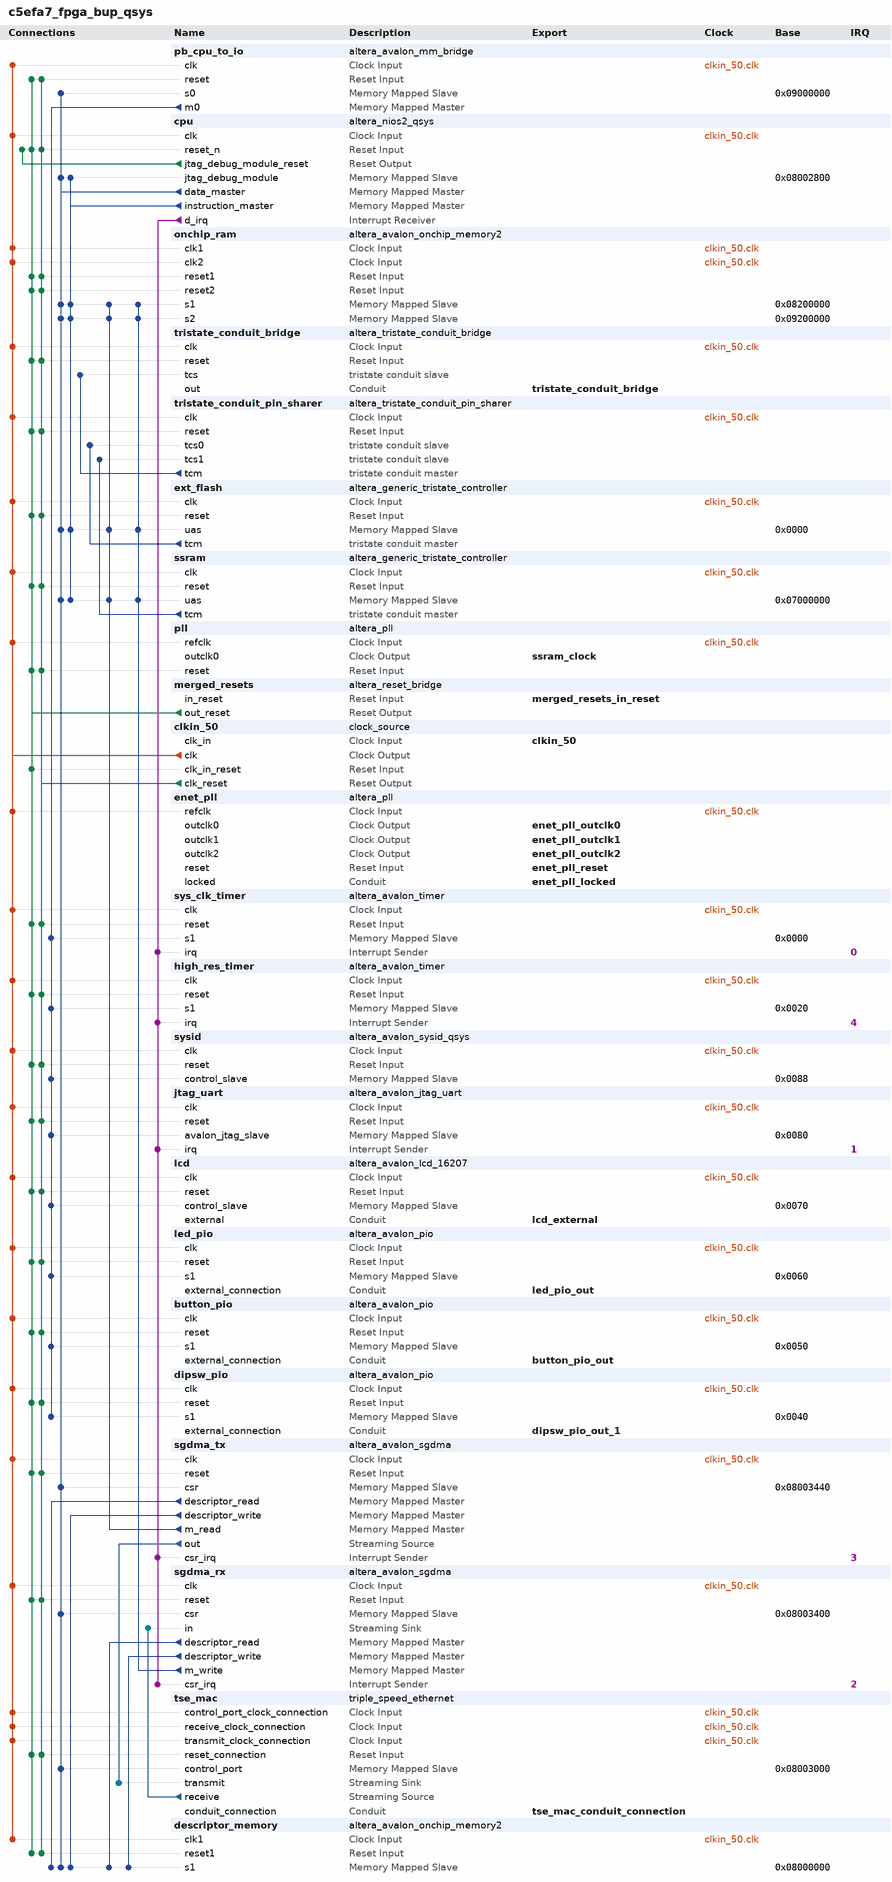
[diagram p0: system contents]
# Platform Designer (Qsys) system c5efa7_fpga_bup_qsys, Cyclone V 5CEFA7F31I7
# Parameters at their usual value, and those the tool derives, are not listed.
package require -exact qsys 12.1
create_system c5efa7_fpga_bup_qsys
set_project_property DEVICE_FAMILY {Cyclone V}
set_project_property DEVICE 5CEFA7F31I7

add_instance pb_cpu_to_io altera_avalon_mm_bridge 12.1
set_instance_parameter_value pb_cpu_to_io DATA_WIDTH 32
set_instance_parameter_value pb_cpu_to_io ADDRESS_WIDTH 10
set_instance_parameter_value pb_cpu_to_io ADDRESS_UNITS SYMBOLS
set_instance_parameter_value pb_cpu_to_io MAX_PENDING_RESPONSES 19

add_instance cpu altera_nios2_qsys 12.1
set_instance_parameter_value cpu manuallyAssignCpuID false
set_instance_parameter_value cpu resetOffset 29097984
set_instance_parameter_value cpu resetSlave ext_flash.uas
set_instance_parameter_value cpu exceptionSlave onchip_ram.s1
set_instance_parameter_value cpu breakSlave cpu.jtag_debug_module
set_instance_parameter_value cpu impl Fast
set_instance_parameter_value cpu icache_size 32768
set_instance_parameter_value cpu dcache_size 32768

add_instance onchip_ram altera_avalon_onchip_memory2 12.1
set_instance_parameter_value onchip_ram blockType M10K
set_instance_parameter_value onchip_ram dataWidth 32
set_instance_parameter_value onchip_ram dualPort true
set_instance_parameter_value onchip_ram initMemContent true
set_instance_parameter_value onchip_ram initializationFileName onchip_ram
set_instance_parameter_value onchip_ram memorySize 524288

add_instance tristate_conduit_bridge altera_tristate_conduit_bridge 12.1

add_instance tristate_conduit_pin_sharer altera_tristate_conduit_pin_sharer 12.1
set_instance_parameter_value tristate_conduit_pin_sharer NUM_INTERFACES 2
set_instance_parameter_value tristate_conduit_pin_sharer MODULE_ORIGIN_LIST ssram.tcm,ssram.tcm,ssram.tcm,ssram.tcm,ssram.tcm,ssram.tcm,ext_flash.tcm,ext_flash.tcm,ext_flash.tcm,ext_flash.tcm,ext_flash.tcm
set_instance_parameter_value tristate_conduit_pin_sharer SIGNAL_ORIGIN_LIST address,outputenable_n,byteenable_n,write_n,data,chipselect_n,address,read_n,write_n,data,chipselect_n
set_instance_parameter_value tristate_conduit_pin_sharer SHARED_SIGNAL_LIST fsm_add,,,,fsm_data,,fsm_add,,,fsm_data

add_instance ext_flash altera_generic_tristate_controller 12.1
set_instance_parameter_value ext_flash TCM_ADDRESS_W 26
set_instance_parameter_value ext_flash TCM_DATA_W 16
set_instance_parameter_value ext_flash TCM_BYTEENABLE_W 2
set_instance_parameter_value ext_flash TCM_READ_WAIT 135
set_instance_parameter_value ext_flash TCM_WRITE_WAIT 135
set_instance_parameter_value ext_flash TCM_SETUP_WAIT 25
set_instance_parameter_value ext_flash TCM_DATA_HOLD 20
set_instance_parameter_value ext_flash TCM_MAX_PENDING_READ_TRANSACTIONS 3
set_instance_parameter_value ext_flash TCM_TURNAROUND_TIME 2
set_instance_parameter_value ext_flash TCM_TIMING_UNITS 0
set_instance_parameter_value ext_flash TCM_READLATENCY 2
set_instance_parameter_value ext_flash TCM_SYMBOLS_PER_WORD 2
set_instance_parameter_value ext_flash USE_READ 1
set_instance_parameter_value ext_flash USE_BEGINTRANSFER 0
set_instance_parameter_value ext_flash USE_BYTEENABLE 0
set_instance_parameter_value ext_flash USE_OUTPUTENABLE 0
set_instance_parameter_value ext_flash ACTIVE_LOW_READ 1
set_instance_parameter_value ext_flash ACTIVE_LOW_BYTEENABLE 0
set_instance_parameter_value ext_flash ACTIVE_LOW_OUTPUTENABLE 0
set_instance_parameter_value ext_flash ACTIVE_LOW_BEGINTRANSFER 0
set_instance_parameter_value ext_flash CHIPSELECT_THROUGH_READLATENCY 0
set_instance_parameter_value ext_flash MODULE_ASSIGNMENT_KEYS embeddedsw.configuration.hwClassnameDriverSupportList,embeddedsw.configuration.hwClassnameDriverSupportDefault,embeddedsw.CMacro.SETUP_VALUE,embeddedsw.CMacro.WAIT_VALUE,embeddedsw.CMacro.HOLD_VALUE,embeddedsw.CMacro.TIMING_UNITS,embeddedsw.CMacro.SIZE,embeddedsw.memoryInfo.MEM_INIT_DATA_WIDTH,embeddedsw.memoryInfo.HAS_BYTE_LANE,embeddedsw.memoryInfo.IS_FLASH,embeddedsw.memoryInfo.GENERATE_DAT_SYM,embeddedsw.memoryInfo.GENERATE_FLASH,embeddedsw.memoryInfo.DAT_SYM_INSTALL_DIR,embeddedsw.memoryInfo.FLASH_INSTALL_DIR
set_instance_parameter_value ext_flash MODULE_ASSIGNMENT_VALUES {altera_avalon_lan91c111:altera_avalon_cfi_flash,altera_avalon_cfi_flash,75,35,1,"ns",67108864u,16,1,1,1,1,SIM_DIR,APP_DIR}
set_instance_parameter_value ext_flash INTERFACE_ASSIGNMENT_KEYS embeddedsw.configuration.isFlash,embeddedsw.configuration.isMemoryDevice,embeddedsw.configuration.isNonVolatileStorage
set_instance_parameter_value ext_flash INTERFACE_ASSIGNMENT_VALUES 1,1,1

add_instance ssram altera_generic_tristate_controller 12.1
set_instance_parameter_value ssram TCM_ADDRESS_W 21
set_instance_parameter_value ssram TCM_DATA_W 16
set_instance_parameter_value ssram TCM_BYTEENABLE_W 2
set_instance_parameter_value ssram TCM_READ_WAIT 200
set_instance_parameter_value ssram TCM_WRITE_WAIT 200
set_instance_parameter_value ssram TCM_SETUP_WAIT 200
set_instance_parameter_value ssram TCM_DATA_HOLD 200
set_instance_parameter_value ssram TCM_MAX_PENDING_READ_TRANSACTIONS 5
set_instance_parameter_value ssram TCM_TURNAROUND_TIME 2
set_instance_parameter_value ssram TCM_TIMING_UNITS 0
set_instance_parameter_value ssram TCM_READLATENCY 4
set_instance_parameter_value ssram TCM_SYMBOLS_PER_WORD 2
set_instance_parameter_value ssram USE_READ 0
set_instance_parameter_value ssram USE_BEGINTRANSFER 0
set_instance_parameter_value ssram USE_BYTEENABLE 1
set_instance_parameter_value ssram USE_OUTPUTENABLE 1
set_instance_parameter_value ssram ACTIVE_LOW_READ 0
set_instance_parameter_value ssram ACTIVE_LOW_BYTEENABLE 1
set_instance_parameter_value ssram ACTIVE_LOW_OUTPUTENABLE 1
set_instance_parameter_value ssram ACTIVE_LOW_BEGINTRANSFER 1
set_instance_parameter_value ssram ACTIVE_LOW_RESET_OUTPUT 1
set_instance_parameter_value ssram CHIPSELECT_THROUGH_READLATENCY 1
set_instance_parameter_value ssram MODULE_ASSIGNMENT_KEYS embeddedsw.configuration.hwClassnameDriverSupportList,embeddedsw.CMacro.SRAM_MEMORY_SIZE,embeddedsw.CMacro.SRAM_MEMORY_UNITS,embeddedsw.CMacro.SSRAM_DATA_WIDTH,embeddedsw.CMacro.SSRAM_READ_LATENCY,embeddedsw.memoryInfo.MEM_INIT_DATA_WIDTH,embeddedsw.memoryInfo.HAS_BYTE_LANE,embeddedsw.memoryInfo.GENERATE_DAT_SYM,embeddedsw.memoryInfo.DAT_SYM_INSTALL_DIR
set_instance_parameter_value ssram MODULE_ASSIGNMENT_VALUES altera_avalon_lan91c111:altera_avalon_cfi_flash,2,524288,32,2,32,1,1,SIM_DIR
set_instance_parameter_value ssram INTERFACE_ASSIGNMENT_KEYS embeddedsw.configuration.isMemoryDevice
set_instance_parameter_value ssram INTERFACE_ASSIGNMENT_VALUES 1

add_instance pll altera_pll 12.1
set_instance_parameter_value pll gui_device_speed_grade 8
set_instance_parameter_value pll gui_pll_mode {Integer-N PLL}
set_instance_parameter_value pll gui_reference_clock_frequency 50.0
set_instance_parameter_value pll gui_operation_mode normal
set_instance_parameter_value pll gui_fractional_cout 24
set_instance_parameter_value pll gui_use_locked false
set_instance_parameter_value pll gui_number_of_clocks 1
set_instance_parameter_value pll gui_output_clock_frequency0 50.0

add_instance merged_resets altera_reset_bridge 12.1
set_instance_parameter_value merged_resets ACTIVE_LOW_RESET 1
set_instance_parameter_value merged_resets SYNCHRONOUS_EDGES none

add_instance clkin_50 clock_source 12.1
set_instance_parameter_value clkin_50 clockFrequency 50000000

add_instance enet_pll altera_pll 12.1
set_instance_parameter_value enet_pll gui_device_speed_grade 7
set_instance_parameter_value enet_pll gui_pll_mode {Integer-N PLL}
set_instance_parameter_value enet_pll gui_reference_clock_frequency 50.0
set_instance_parameter_value enet_pll gui_operation_mode normal
set_instance_parameter_value enet_pll gui_fractional_cout 24
set_instance_parameter_value enet_pll gui_use_locked true
set_instance_parameter_value enet_pll gui_number_of_clocks 3
set_instance_parameter_value enet_pll gui_output_clock_frequency0 125.0
set_instance_parameter_value enet_pll gui_output_clock_frequency1 25.0
set_instance_parameter_value enet_pll gui_phase_shift_deg1 0
set_instance_parameter_value enet_pll gui_output_clock_frequency2 2.5

add_instance sys_clk_timer altera_avalon_timer 12.1
set_instance_parameter_value sys_clk_timer period 10
set_instance_parameter_value sys_clk_timer periodUnits MSEC
set_instance_parameter_value sys_clk_timer timerPreset CUSTOM

add_instance high_res_timer altera_avalon_timer 12.1
set_instance_parameter_value high_res_timer period 10
set_instance_parameter_value high_res_timer periodUnits USEC
set_instance_parameter_value high_res_timer timerPreset CUSTOM

add_instance sysid altera_avalon_sysid_qsys 12.1
set_instance_parameter_value sysid id -87110914

add_instance jtag_uart altera_avalon_jtag_uart 12.1
set_instance_parameter_value jtag_uart simInteractiveOptions INTERACTIVE_ASCII_OUTPUT

add_instance lcd altera_avalon_lcd_16207 12.1

add_instance led_pio altera_avalon_pio 12.1
set_instance_parameter_value led_pio direction Output
set_instance_parameter_value led_pio resetValue 15
set_instance_parameter_value led_pio width 4

add_instance button_pio altera_avalon_pio 12.1
set_instance_parameter_value button_pio direction Input
set_instance_parameter_value button_pio width 4

add_instance dipsw_pio altera_avalon_pio 12.1
set_instance_parameter_value dipsw_pio direction Input
set_instance_parameter_value dipsw_pio width 4

add_instance sgdma_tx altera_avalon_sgdma 12.1
set_instance_parameter_value sgdma_tx enableBurstTransfers false
set_instance_parameter_value sgdma_tx enableUnalignedTransfers false
set_instance_parameter_value sgdma_tx readBlockDataWidth 32
set_instance_parameter_value sgdma_tx sinkErrorWidth 0
set_instance_parameter_value sgdma_tx sourceErrorWidth 1
set_instance_parameter_value sgdma_tx transferMode MEMORY_TO_STREAM
set_instance_parameter_value sgdma_tx writeBurstcountWidth 4

add_instance sgdma_rx altera_avalon_sgdma 12.1
set_instance_parameter_value sgdma_rx enableBurstTransfers false
set_instance_parameter_value sgdma_rx enableUnalignedTransfers false
set_instance_parameter_value sgdma_rx readBlockDataWidth 32
set_instance_parameter_value sgdma_rx sinkErrorWidth 6
set_instance_parameter_value sgdma_rx sourceErrorWidth 0
set_instance_parameter_value sgdma_rx transferMode STREAM_TO_MEMORY
set_instance_parameter_value sgdma_rx writeBurstcountWidth 4

add_instance tse_mac triple_speed_ethernet 12.1
set_instance_parameter_value tse_mac atlanticSinkClockRate 0
set_instance_parameter_value tse_mac atlanticSinkClockSource unassigned
set_instance_parameter_value tse_mac atlanticSourceClockRate 0
set_instance_parameter_value tse_mac atlanticSourceClockSource unassigned
set_instance_parameter_value tse_mac avalonSlaveClockRate 0
set_instance_parameter_value tse_mac avalonSlaveClockSource unassigned
set_instance_parameter_value tse_mac avalonStNeighbours {unassigned=unassigned}
set_instance_parameter_value tse_mac channel_count 1
set_instance_parameter_value tse_mac core_variation MAC_ONLY
set_instance_parameter_value tse_mac core_version 3073
set_instance_parameter_value tse_mac crc32check16bit 0
set_instance_parameter_value tse_mac crc32dwidth 8
set_instance_parameter_value tse_mac crc32gendelay 6
set_instance_parameter_value tse_mac crc32s1l2_extern false
set_instance_parameter_value tse_mac cust_version 0
set_instance_parameter_value tse_mac dataBitsPerSymbol 8
set_instance_parameter_value tse_mac dev_version 3073
set_instance_parameter_value tse_mac eg_addr 12
set_instance_parameter_value tse_mac ena_hash false
set_instance_parameter_value tse_mac enable_alt_reconfig false
set_instance_parameter_value tse_mac enable_clk_sharing false
set_instance_parameter_value tse_mac enable_ena 32
set_instance_parameter_value tse_mac enable_fifoless false
set_instance_parameter_value tse_mac enable_gmii_loopback false
set_instance_parameter_value tse_mac enable_hd_logic true
set_instance_parameter_value tse_mac enable_mac_flow_ctrl true
set_instance_parameter_value tse_mac enable_mac_txaddr_set true
set_instance_parameter_value tse_mac enable_mac_vlan false
set_instance_parameter_value tse_mac enable_maclite false
set_instance_parameter_value tse_mac enable_magic_detect false
set_instance_parameter_value tse_mac enable_multi_channel false
set_instance_parameter_value tse_mac enable_pkt_class true
set_instance_parameter_value tse_mac enable_pma false
set_instance_parameter_value tse_mac enable_ptp_1step false
set_instance_parameter_value tse_mac enable_reg_sharing false
set_instance_parameter_value tse_mac enable_sgmii false
set_instance_parameter_value tse_mac enable_shift16 true
set_instance_parameter_value tse_mac enable_sup_addr false
set_instance_parameter_value tse_mac enable_timestamping false
set_instance_parameter_value tse_mac enable_use_internal_fifo true
set_instance_parameter_value tse_mac export_calblkclk false
set_instance_parameter_value tse_mac export_pwrdn false
set_instance_parameter_value tse_mac ext_stat_cnt_ena false
set_instance_parameter_value tse_mac gigeAdvanceMode true
set_instance_parameter_value tse_mac ifGMII RGMII
set_instance_parameter_value tse_mac ifPCSuseEmbeddedSerdes false
set_instance_parameter_value tse_mac ing_addr 12
set_instance_parameter_value tse_mac insert_ta true
set_instance_parameter_value tse_mac maclite_gige false
set_instance_parameter_value tse_mac max_channels 1
set_instance_parameter_value tse_mac mdio_clk_div 30
set_instance_parameter_value tse_mac phy_identifier 0
set_instance_parameter_value tse_mac ramType AUTO
set_instance_parameter_value tse_mac reset_level 1
set_instance_parameter_value tse_mac starting_channel_number 0
set_instance_parameter_value tse_mac stat_cnt_ena true
set_instance_parameter_value tse_mac timingAdapterName timingAdapter
set_instance_parameter_value tse_mac toolContext SOPC_BUILDER
set_instance_parameter_value tse_mac transceiver_type GXB
set_instance_parameter_value tse_mac tstamp_fp_width 4
set_instance_parameter_value tse_mac uiHostClockFrequency 0
set_instance_parameter_value tse_mac uiMDIOFreq {0.0 MHz}
set_instance_parameter_value tse_mac useLvds false
set_instance_parameter_value tse_mac useMAC true
set_instance_parameter_value tse_mac useMDIO true
set_instance_parameter_value tse_mac usePCS false
set_instance_parameter_value tse_mac use_sync_reset true

add_instance descriptor_memory altera_avalon_onchip_memory2 12.1
set_instance_parameter_value descriptor_memory dataWidth 32
set_instance_parameter_value descriptor_memory dualPort false
set_instance_parameter_value descriptor_memory initMemContent true
set_instance_parameter_value descriptor_memory initializationFileName descriptor_memory
set_instance_parameter_value descriptor_memory memorySize 8192

# connections
add_connection clkin_50.clk button_pio.clk clock
add_connection clkin_50.clk cpu.clk clock
add_connection clkin_50.clk descriptor_memory.clk1 clock
add_connection clkin_50.clk dipsw_pio.clk clock
add_connection clkin_50.clk enet_pll.refclk clock
add_connection clkin_50.clk ext_flash.clk clock
add_connection clkin_50.clk high_res_timer.clk clock
add_connection clkin_50.clk jtag_uart.clk clock
add_connection clkin_50.clk lcd.clk clock
add_connection clkin_50.clk led_pio.clk clock
add_connection clkin_50.clk onchip_ram.clk1 clock
add_connection clkin_50.clk onchip_ram.clk2 clock
add_connection clkin_50.clk pb_cpu_to_io.clk clock
add_connection clkin_50.clk pll.refclk clock
add_connection clkin_50.clk sgdma_rx.clk clock
add_connection clkin_50.clk sgdma_tx.clk clock
add_connection clkin_50.clk ssram.clk clock
add_connection clkin_50.clk sys_clk_timer.clk clock
add_connection clkin_50.clk sysid.clk clock
add_connection clkin_50.clk tristate_conduit_bridge.clk clock
add_connection clkin_50.clk tristate_conduit_pin_sharer.clk clock
add_connection clkin_50.clk tse_mac.control_port_clock_connection clock
add_connection clkin_50.clk tse_mac.receive_clock_connection clock
add_connection clkin_50.clk tse_mac.transmit_clock_connection clock
add_connection clkin_50.clk_reset button_pio.reset reset
add_connection clkin_50.clk_reset cpu.reset_n reset
add_connection clkin_50.clk_reset descriptor_memory.reset1 reset
add_connection clkin_50.clk_reset dipsw_pio.reset reset
add_connection clkin_50.clk_reset ext_flash.reset reset
add_connection clkin_50.clk_reset high_res_timer.reset reset
add_connection clkin_50.clk_reset jtag_uart.reset reset
add_connection clkin_50.clk_reset lcd.reset reset
add_connection clkin_50.clk_reset led_pio.reset reset
add_connection clkin_50.clk_reset onchip_ram.reset1 reset
add_connection clkin_50.clk_reset onchip_ram.reset2 reset
add_connection clkin_50.clk_reset pb_cpu_to_io.reset reset
add_connection clkin_50.clk_reset pll.reset reset
add_connection clkin_50.clk_reset sgdma_rx.reset reset
add_connection clkin_50.clk_reset sgdma_tx.reset reset
add_connection clkin_50.clk_reset ssram.reset reset
add_connection clkin_50.clk_reset sys_clk_timer.reset reset
add_connection clkin_50.clk_reset sysid.reset reset
add_connection clkin_50.clk_reset tristate_conduit_bridge.reset reset
add_connection clkin_50.clk_reset tristate_conduit_pin_sharer.reset reset
add_connection clkin_50.clk_reset tse_mac.reset_connection reset
add_connection cpu.jtag_debug_module_reset cpu.reset_n reset
add_connection merged_resets.out_reset button_pio.reset reset
add_connection merged_resets.out_reset clkin_50.clk_in_reset reset
add_connection merged_resets.out_reset cpu.reset_n reset
add_connection merged_resets.out_reset descriptor_memory.reset1 reset
add_connection merged_resets.out_reset dipsw_pio.reset reset
add_connection merged_resets.out_reset ext_flash.reset reset
add_connection merged_resets.out_reset high_res_timer.reset reset
add_connection merged_resets.out_reset jtag_uart.reset reset
add_connection merged_resets.out_reset lcd.reset reset
add_connection merged_resets.out_reset led_pio.reset reset
add_connection merged_resets.out_reset onchip_ram.reset1 reset
add_connection merged_resets.out_reset onchip_ram.reset2 reset
add_connection merged_resets.out_reset pb_cpu_to_io.reset reset
add_connection merged_resets.out_reset pll.reset reset
add_connection merged_resets.out_reset sgdma_rx.reset reset
add_connection merged_resets.out_reset sgdma_tx.reset reset
add_connection merged_resets.out_reset ssram.reset reset
add_connection merged_resets.out_reset sys_clk_timer.reset reset
add_connection merged_resets.out_reset sysid.reset reset
add_connection merged_resets.out_reset tristate_conduit_bridge.reset reset
add_connection merged_resets.out_reset tristate_conduit_pin_sharer.reset reset
add_connection merged_resets.out_reset tse_mac.reset_connection reset
add_connection cpu.data_master cpu.jtag_debug_module avalon
set_connection_parameter_value cpu.data_master/cpu.jtag_debug_module baseAddress 0x08002800
add_connection cpu.data_master descriptor_memory.s1 avalon
set_connection_parameter_value cpu.data_master/descriptor_memory.s1 baseAddress 0x08000000
add_connection cpu.data_master ext_flash.uas avalon
set_connection_parameter_value cpu.data_master/ext_flash.uas baseAddress 0x0000
add_connection cpu.data_master onchip_ram.s1 avalon
set_connection_parameter_value cpu.data_master/onchip_ram.s1 baseAddress 0x08200000
add_connection cpu.data_master onchip_ram.s2 avalon
set_connection_parameter_value cpu.data_master/onchip_ram.s2 baseAddress 0x09200000
add_connection cpu.data_master pb_cpu_to_io.s0 avalon
set_connection_parameter_value cpu.data_master/pb_cpu_to_io.s0 baseAddress 0x09000000
add_connection cpu.data_master sgdma_rx.csr avalon
set_connection_parameter_value cpu.data_master/sgdma_rx.csr baseAddress 0x08003400
add_connection cpu.data_master sgdma_tx.csr avalon
set_connection_parameter_value cpu.data_master/sgdma_tx.csr baseAddress 0x08003440
add_connection cpu.data_master ssram.uas avalon
set_connection_parameter_value cpu.data_master/ssram.uas baseAddress 0x07000000
add_connection cpu.data_master tse_mac.control_port avalon
set_connection_parameter_value cpu.data_master/tse_mac.control_port baseAddress 0x08003000
add_connection cpu.instruction_master cpu.jtag_debug_module avalon
set_connection_parameter_value cpu.instruction_master/cpu.jtag_debug_module baseAddress 0x08002800
add_connection cpu.instruction_master ext_flash.uas avalon
set_connection_parameter_value cpu.instruction_master/ext_flash.uas baseAddress 0x0000
add_connection cpu.instruction_master onchip_ram.s1 avalon
set_connection_parameter_value cpu.instruction_master/onchip_ram.s1 baseAddress 0x08200000
add_connection cpu.instruction_master onchip_ram.s2 avalon
set_connection_parameter_value cpu.instruction_master/onchip_ram.s2 baseAddress 0x09200000
add_connection cpu.instruction_master ssram.uas avalon
set_connection_parameter_value cpu.instruction_master/ssram.uas baseAddress 0x07000000
add_connection pb_cpu_to_io.m0 button_pio.s1 avalon
set_connection_parameter_value pb_cpu_to_io.m0/button_pio.s1 baseAddress 0x0050
add_connection pb_cpu_to_io.m0 dipsw_pio.s1 avalon
set_connection_parameter_value pb_cpu_to_io.m0/dipsw_pio.s1 baseAddress 0x0040
add_connection pb_cpu_to_io.m0 high_res_timer.s1 avalon
set_connection_parameter_value pb_cpu_to_io.m0/high_res_timer.s1 baseAddress 0x0020
add_connection pb_cpu_to_io.m0 jtag_uart.avalon_jtag_slave avalon
set_connection_parameter_value pb_cpu_to_io.m0/jtag_uart.avalon_jtag_slave baseAddress 0x0080
add_connection pb_cpu_to_io.m0 lcd.control_slave avalon
set_connection_parameter_value pb_cpu_to_io.m0/lcd.control_slave baseAddress 0x0070
add_connection pb_cpu_to_io.m0 led_pio.s1 avalon
set_connection_parameter_value pb_cpu_to_io.m0/led_pio.s1 baseAddress 0x0060
add_connection pb_cpu_to_io.m0 sys_clk_timer.s1 avalon
set_connection_parameter_value pb_cpu_to_io.m0/sys_clk_timer.s1 baseAddress 0x0000
add_connection pb_cpu_to_io.m0 sysid.control_slave avalon
set_connection_parameter_value pb_cpu_to_io.m0/sysid.control_slave baseAddress 0x0088
add_connection sgdma_rx.descriptor_read descriptor_memory.s1 avalon
set_connection_parameter_value sgdma_rx.descriptor_read/descriptor_memory.s1 baseAddress 0x08000000
add_connection sgdma_rx.descriptor_write descriptor_memory.s1 avalon
set_connection_parameter_value sgdma_rx.descriptor_write/descriptor_memory.s1 baseAddress 0x08000000
add_connection sgdma_rx.m_write ext_flash.uas avalon
set_connection_parameter_value sgdma_rx.m_write/ext_flash.uas baseAddress 0x0000
add_connection sgdma_rx.m_write onchip_ram.s1 avalon
set_connection_parameter_value sgdma_rx.m_write/onchip_ram.s1 baseAddress 0x08200000
add_connection sgdma_rx.m_write onchip_ram.s2 avalon
set_connection_parameter_value sgdma_rx.m_write/onchip_ram.s2 baseAddress 0x09200000
add_connection sgdma_rx.m_write ssram.uas avalon
set_connection_parameter_value sgdma_rx.m_write/ssram.uas baseAddress 0x07000000
add_connection sgdma_tx.descriptor_read descriptor_memory.s1 avalon
set_connection_parameter_value sgdma_tx.descriptor_read/descriptor_memory.s1 baseAddress 0x08000000
add_connection sgdma_tx.descriptor_write descriptor_memory.s1 avalon
set_connection_parameter_value sgdma_tx.descriptor_write/descriptor_memory.s1 baseAddress 0x08000000
add_connection sgdma_tx.m_read ext_flash.uas avalon
set_connection_parameter_value sgdma_tx.m_read/ext_flash.uas baseAddress 0x0000
add_connection sgdma_tx.m_read onchip_ram.s1 avalon
set_connection_parameter_value sgdma_tx.m_read/onchip_ram.s1 baseAddress 0x08200000
add_connection sgdma_tx.m_read onchip_ram.s2 avalon
set_connection_parameter_value sgdma_tx.m_read/onchip_ram.s2 baseAddress 0x09200000
add_connection sgdma_tx.m_read ssram.uas avalon
set_connection_parameter_value sgdma_tx.m_read/ssram.uas baseAddress 0x07000000
add_connection sgdma_tx.out tse_mac.transmit avalon_streaming
add_connection tse_mac.receive sgdma_rx.in avalon_streaming
add_connection cpu.d_irq high_res_timer.irq interrupt
set_connection_parameter_value cpu.d_irq/high_res_timer.irq irqNumber 4
add_connection cpu.d_irq jtag_uart.irq interrupt
set_connection_parameter_value cpu.d_irq/jtag_uart.irq irqNumber 1
add_connection cpu.d_irq sgdma_rx.csr_irq interrupt
set_connection_parameter_value cpu.d_irq/sgdma_rx.csr_irq irqNumber 2
add_connection cpu.d_irq sgdma_tx.csr_irq interrupt
set_connection_parameter_value cpu.d_irq/sgdma_tx.csr_irq irqNumber 3
add_connection cpu.d_irq sys_clk_timer.irq interrupt
set_connection_parameter_value cpu.d_irq/sys_clk_timer.irq irqNumber 0
add_connection ext_flash.tcm tristate_conduit_pin_sharer.tcs0 tristate_conduit
add_connection ssram.tcm tristate_conduit_pin_sharer.tcs1 tristate_conduit
add_connection tristate_conduit_pin_sharer.tcm tristate_conduit_bridge.tcs tristate_conduit

# exported interfaces
add_interface tse_mac_conduit_connection conduit end
set_interface_property tse_mac_conduit_connection EXPORT_OF tse_mac.conduit_connection
add_interface clkin_50 clock sink
set_interface_property clkin_50 EXPORT_OF clkin_50.clk_in
add_interface tristate_conduit_bridge conduit end
set_interface_property tristate_conduit_bridge EXPORT_OF tristate_conduit_bridge.out
add_interface merged_resets_in_reset reset sink
set_interface_property merged_resets_in_reset EXPORT_OF merged_resets.in_reset
add_interface enet_pll_outclk2 clock source
set_interface_property enet_pll_outclk2 EXPORT_OF enet_pll.outclk2
add_interface enet_pll_outclk1 clock source
set_interface_property enet_pll_outclk1 EXPORT_OF enet_pll.outclk1
add_interface enet_pll_outclk0 clock source
set_interface_property enet_pll_outclk0 EXPORT_OF enet_pll.outclk0
add_interface enet_pll_locked conduit end
set_interface_property enet_pll_locked EXPORT_OF enet_pll.locked
add_interface enet_pll_reset reset sink
set_interface_property enet_pll_reset EXPORT_OF enet_pll.reset
add_interface lcd_external conduit end
set_interface_property lcd_external EXPORT_OF lcd.external
add_interface led_pio_out conduit end
set_interface_property led_pio_out EXPORT_OF led_pio.external_connection
add_interface button_pio_out conduit end
set_interface_property button_pio_out EXPORT_OF button_pio.external_connection
add_interface dipsw_pio_out_1 conduit end
set_interface_property dipsw_pio_out_1 EXPORT_OF dipsw_pio.external_connection
add_interface ssram_clock clock source
set_interface_property ssram_clock EXPORT_OF pll.outclk0

save_system c5efa7_fpga_bup_qsys.qsys
